# EAGLE design Asistente_Alzhaimer (EAGLE 7.6.0)
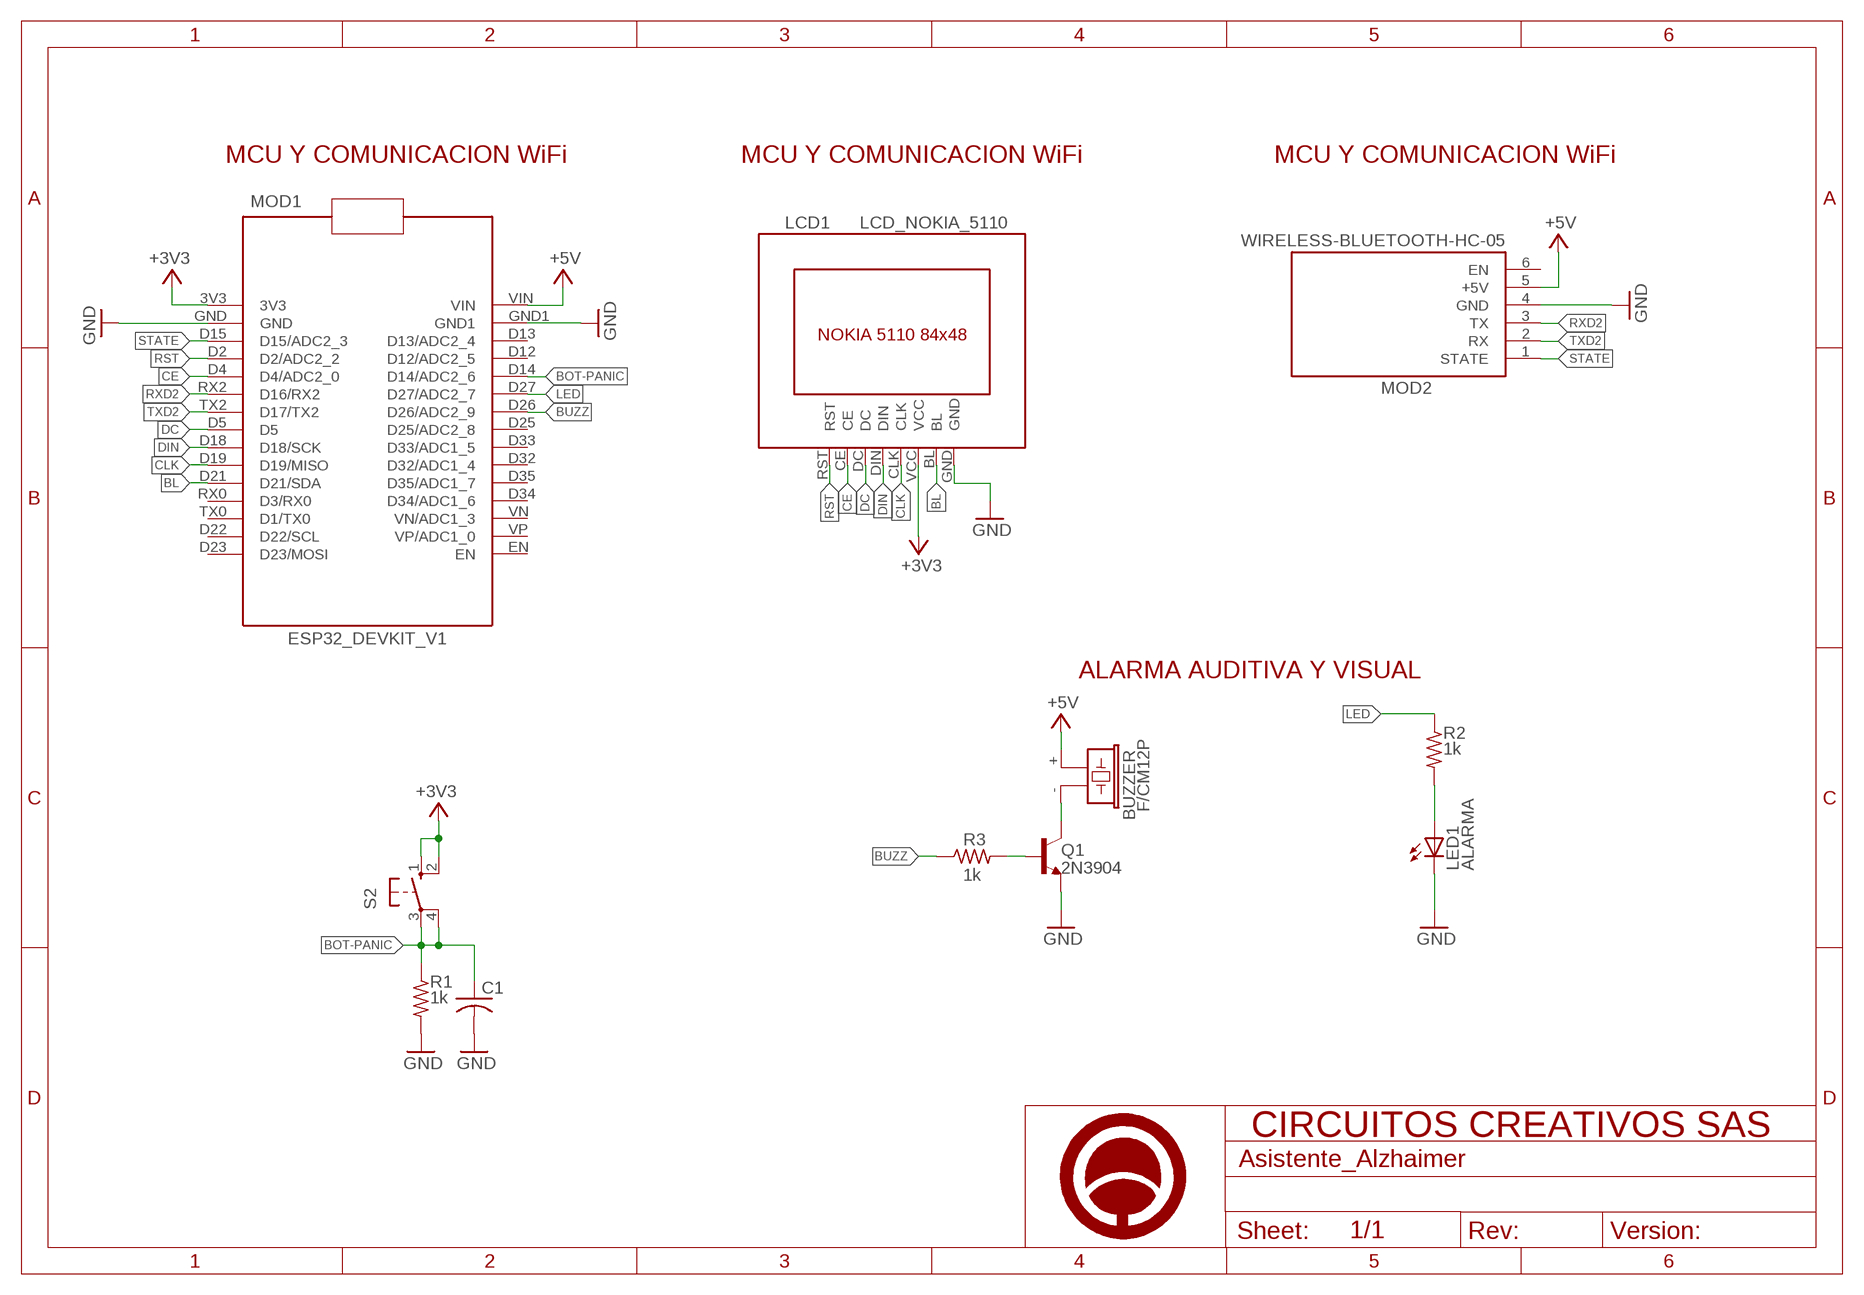
[diagram p0: schematic, sheet 1]

## Parts
BUZZER  F/CM12P  [F/CM12P]
C1  C-US050-025X075  [C050-025X075]
LCD1  LCD_NOKIA_5110  [NOKIA_5110_THT]
LED1  ALARMA  LED3MM  [LED3MM]
MOD1  ESP32_DEVKIT_V1  [ESP32_DEVKIT_V1]
MOD2  WIRELESS-BLUETOOTH-HC-05  [WIRELESS-BLUETOOTH-HC-05]
Q1  2N3904  [TO-92]
R1  1k  R-US_0204/7  [0204/7]
R2  1k  R-US_0204/7  [0204/7]
R3  1k  R-US_0204/7  [0204/7]
S2  10-XX  [B3F-10XX]
U$1  A4_HORIZONTAL  [LOGO]

## Nets
+3V3: LCD1.VCC MOD1.3V3 S2.1(S) S2.2(S1)
+5V: BUZZER.+ MOD1.VIN MOD2.5(+5V)
BL: LCD1.BL MOD1.D21(D21/SDA)
BOT-PANIC: C1.1 MOD1.D14(D14/ADC2_6) R1.1 S2.3(P) S2.4(P1)
BUZZ: MOD1.D26(D26/ADC2_9) R3.1
CE: LCD1.CE MOD1.D4(D4/ADC2_0)
CLK: LCD1.CLK MOD1.D19(D19/MISO)
DC: LCD1.DC MOD1.D5
DIN: LCD1.DIN MOD1.D18(D18/SCK)
GND [PWR]: C1.2 LCD1.GND LED1.K(C) MOD1.GND MOD1.GND1 MOD2.4(GND) Q1.1(E) R1.2
LED: MOD1.D27(D27/ADC2_7) R2.1
N$1: LED1.A R2.2
N$7: Q1.2(B) R3.2
N$9: BUZZER.- Q1.3(C)
RST: LCD1.RST MOD1.D2(D2/ADC2_2)
RXD2: MOD1.RX2(D16/RX2) MOD2.3(TX)
STATE: MOD1.D15(D15/ADC2_3) MOD2.1(STATE)
TXD2: MOD1.TX2(D17/TX2) MOD2.2(RX)
Unconnected: MOD1.D12(D12/ADC2_5) MOD1.D13(D13/ADC2_4) MOD1.D22(D22/SCL) MOD1.D23(D23/MOSI) MOD1.D25(D25/ADC2_8) MOD1.D32(D32/ADC1_4) MOD1.D33(D33/ADC1_5) MOD1.D34(D34/ADC1_6) MOD1.D35(D35/ADC1_7) MOD1.EN MOD1.RX0(D3/RX0) MOD1.TX0(D1/TX0) MOD1.VN(VN/ADC1_3) MOD1.VP(VP/ADC1_0) MOD2.6(EN)

## Notes on the sheet
- MCU Y COMUNICACION WiFi | MCU Y COMUNICACION WiFi | MCU Y COMUNICACION WiFi
- ALARMA AUDITIVA Y VISUAL

## Library data of the parts
BUZZER = buzzer:F/CM12P: BUZZER Source: Buerklin; OC_FARNELL: unknown; OC_NEWARK: unknown
C1 = rcl:C-US: CAPACITOR, American symbol
LCD1 = Circuitos-Creativos-Modulos:LCD_NOKIA_5110: MODULO LCD NOKIA 5110, 84x48 pixeles 3.3V
LED1 = led:LED: LED OSRAM: - CHIPLED LG R971, LG N971, LY N971, LG Q971, LY Q971, LO R971, LY R971 LH N974, LH R974 LS Q976, LO Q976, LY Q976 LO Q996 - Hyper CHIPLED LW Q18S LB Q993, LB Q99A, LB R99A - SideLED LS A670, LO A670, LY A670, LG A670, LP A670 LB A673, LV A673, LT A673, LW A673 LH A674 LY A675 LS A676, LA A676, LO A676, LY A676, LW A676 LS A679, LY A679, LG A679 - Hyper Micro SIDELED® LS Y876, LA Y876, LO Y876, LY Y876 LT Y87S - SmartLED LW L88C, LW L88S LB L89C, LB L89S, LG L890 LS L89K, LO L89K, LY L89K LS L896, LA L896, LO L896, LY L896 - TOPLED LS T670, LO T670, LY T670, LG T670, LP T670 LSG T670, LSP T670, LSY T670, LOP T670, LYG T670 LG T671, LOG T671, LSG T671 LB T673, LV T673, LT T673, LW T673 LH T674 LS T676, LA T676, LO T676, LY T676, LB T676, LH T676, LSB T676, LW T676 LB T67C, LV T67C, LT T67C, LS T67K, LO T67K, LY T67K, LW E67C LS E67B, LA E67B, LO E67B, LY E67B, LB E67C, LV E67C, LT E67C LW T67C LS T679, LY T679, LG T679 LS T770, LO T770, LY T770, LG T770, LP T770 LB T773, LV T773, LT T773, LW T773 LH T774 LS E675, LA E675, LY E675, LS T675 LS T776, LA T776, LO T776, LY T776, LB T776 LHGB T686 LT T68C, LB T68C - Hyper Mini TOPLED® LB M676 - Mini TOPLED Santana® LG M470 LS M47K, LO M47K, LY M47K Source: http://www.osram.convergy.de LUXEON: - LUMILED® LXK2-PW12-R00, LXK2-PW12-S00, LXK2-PW14-U00, LXK2-PW14-V00 LXK2-PM12-R00, LXK2-PM12-S00, LXK2-PM14-U00 LXK2-PE12-Q00, LXK2-PE12-R00, LXK2-PE12-S00, LXK2-PE14-T00, LXK2-PE14-U00 LXK2-PB12-K00, LXK2-PB12-L00, LXK2-PB12-M00, LXK2-PB14-N00, LXK2-PB14-P00, LXK2-PB14-Q00 LXK2-PR12-L00, LXK2-PR12-M00, LXK2-PR14-Q00, LXK2-PR14-R00 LXK2-PD12-Q00, LXK2-PD12-R00, LXK2-PD12-S00 LXK2-PH12-R00, LXK2-PH12-S00 LXK2-PL12-P00, LXK2-PL12-Q00, LXK2-PL12-R00 Source: www.luxeon.com KINGBRIGHT: KA-3528ASYC Source: www.kingbright.com
MOD1 = Circuitos-Creativos-Modulos:ESP32_DEVKIT_V1: Microprocesador de doble nucleo a 80MHz, con WiFi y bBluetooth 4.2, ideal para aplicaciones IOT
MOD2 = diy-modules:WIRELESS-BLUETOOTH-HC-05: Bluetooth Transceiver Module based on HC-05 board Tutorial is available here: https://arduino-info.wikispaces.com/BlueTooth-HC05-HC06-Modules-How-To Click here to find device on ebay.com <http://www.ebay.com/sch/hc-05+module+rs232>
Q1 = Ingenialo:2N3904: transistor NPN de proposito general
R1-R3 = rcl:R-US_: RESISTOR, American symbol
S2 = switch-omron:10-XX: OMRON SWITCH; MPN: B3F-1000; OC_FARNELL: 176432; OC_NEWARK: 36M3542
U$1 = Circuitos-Creativos-Estilos:A4_HORIZONTAL

## Net classes
1 PWR: width 0.305 mm, clearance 0.254 mm

## Board
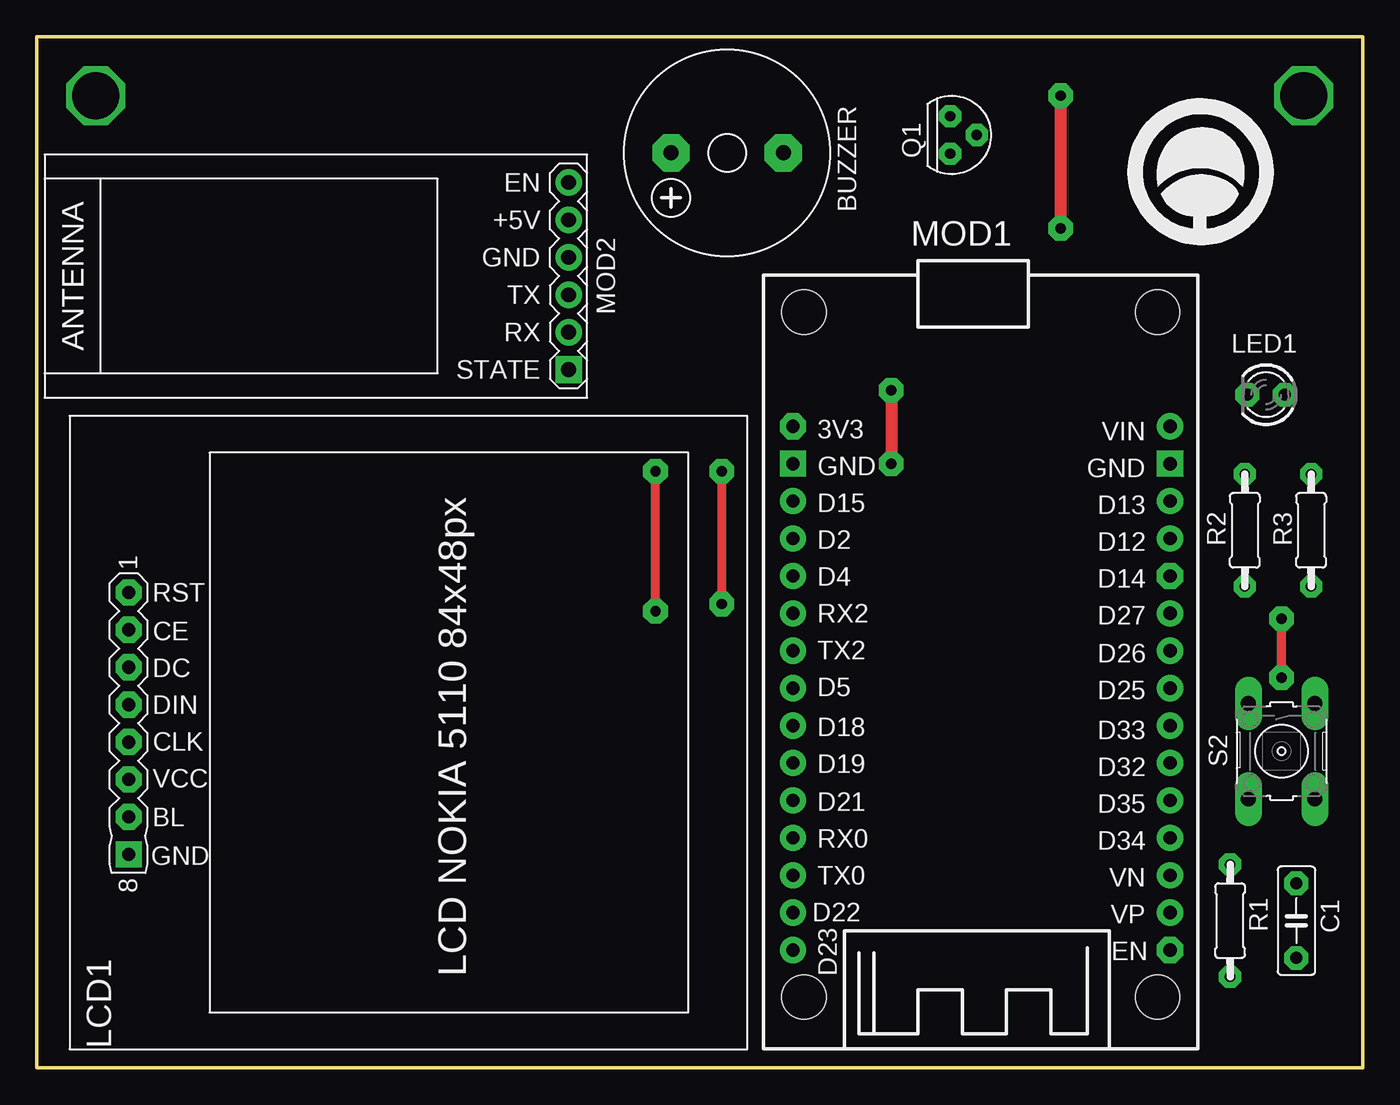
[diagram p1: board, top side]
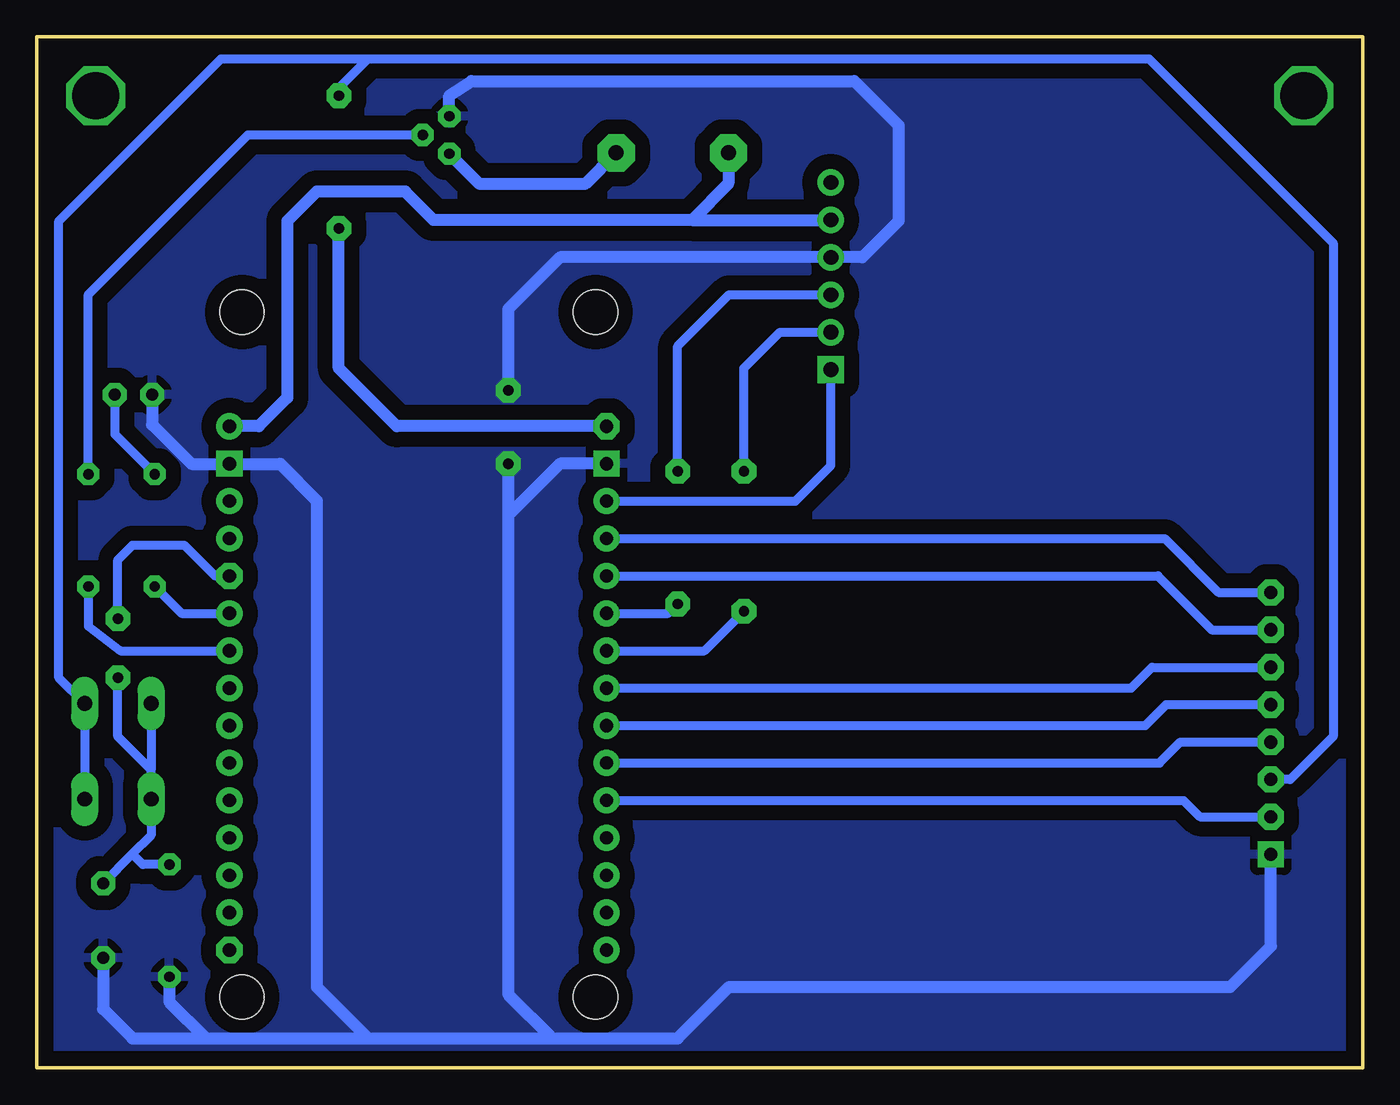
[diagram p2: board, bottom side, seen from below]

Size 90 x 70 mm. Coordinates in mm from the lower left corner, seen from the top.
Outline: 0,0 90,0 90,70 0,70 0,0
Copper layers (1*16): Top 0.035mm / dielectric 1.5mm / Bottom 0.035mm
Design rules "Crcuitos creativos": minimum track width 0.35mm, minimum drill 0.6mm, track to track 10mil, track to pad 10mil, pad to pad 10mil, via to via 10mil, smd to smd 8mil, copper to edge 0.5mm, drill to drill 0.3mm, minimum pad ring 0.4mm, minimum via ring 0.4mm, stop-mask expansion 4mil, vias tented up to drill 0mil, thermal gap 20mil

### Footprints (pad centres in the part's own frame; a part is rotated, then mirrored left to right if it is on the bottom)
F/CM12P = drill 1.016 pad 2.54 octagon: + 3.81,0; - -3.81,0
C050-025X075 = drill 0.813 octagon: 1 -2.54,0; 2 2.54,0
NOKIA_5110_THT = drill 0.9 pad 1.778 octagon: BL 27.225,4; CE 14.525,4; CLK 22.145,4; DC 17.065,4; DIN 19.605,4; RST 11.985,4; VCC 24.685,4 | drill 0.9 pad 1.778 square: GND 29.765,4
LED3MM = drill 0.813 octagon: A -1.27,0; K 1.27,0
ESP32_DEVKIT_V1 = drill 0.9 pad 1.778 octagon: 3V3 2,42.252; D14 27.6,32.092; EN 27.6,6.692 | drill 0.9 pad 1.778: D2 2,34.632; D4 2,32.092; D5 2,24.472; D12 27.6,34.632; D13 27.6,37.172; D15 2,37.172; D18 2,21.932; D19 2,19.392; D21 2,16.852; D22 2,9.232; D23 2,6.692; D25 27.6,24.472; D26 27.6,27.012; D27 27.6,29.552; D32 27.6,19.392; D33 27.6,21.932; D34 27.6,14.312; D35 27.6,16.852; RX0 2,14.312; RX2 2,29.552; TX0 2,11.772; TX2 2,27.012; VIN 27.6,42.252; VN 27.6,11.772; VP 27.6,9.232 | drill 0.9 pad 1.778 square: GND 2,39.712; GND1 27.6,39.712 | hole 3: 26.75,3.5; 2.75,3.5; 2.75,50; 26.75,50
WIRELESS-BLUETOOTH-HC-05 = drill 1 square: 1 -6.35,-17.145 | drill 1: 2 -3.81,-17.145; 3 -1.27,-17.145; 4 1.27,-17.145; 5 3.81,-17.145; 6 6.35,-17.145
TO-92 = drill 0.7 pad 1.27 octagon: 1 -1.37,-0.3; 2 -0.1,1.505; 3 1.17,-0.3
0204/7 = drill 0.7 pad 1.422 octagon: 1 -3.81,0; 2 3.81,0
B3F-10XX = drill 1.016 long: 1 -3.251,2.261; 2 3.251,2.261; 3 -3.251,-2.261; 4 3.251,-2.261

### Placement (x,y rotation side)
BUZZER  46.86,62.12 180 top
C1  85.5,10 270 top
LCD1  2.23,44.27 270 top
LED1  83.44,45.7 180 top
MOD1  49.32,1.31 0 top
MOD2  18.95,53.76 90 top
Q1  62.3,63.24 270 top
R1  81,10 270 top
R2  82,36.5 90 top
R3  86.5,36.5 90 top
S2  84.5,21.5 270 top
U$1  79,60.84 0 top

### Tracks (layer width: path | path; a pad name or v marks a point on that pad's centre or on a via)
+3V3  (via drill 0.7 pad 1.68)
  Top 0.813: v69.5,57 v69.5,66
  Bottom 0.61: 67.5,68.5 77.5,68.5 88.5,57.5 88.5,26.49 S2.1 S2.2 | 67.5,68.5 14.5,68.5 2,56 2,22.5 4.92,19.59 LCD1.VCC | v69.5,66 69.5,66.5 67.5,68.5
  Bottom 0.813: MOD1.3V3 65.56,43.56 69.5,47.5 v69.5,57
+5V
  Bottom 0.813: BUZZER.+ 43.05,60.05 45.53,57.57 | 45.53,57.57 MOD2.5 | 45.53,57.57 63.07,57.57 65,59.5 71,59.5 73,57.5 73,45.5 74.94,43.56 MOD1.VIN
BL
  Bottom 0.61: MOD1.D21 12.16,18.16 11.04,17.05 LCD1.BL
BOT-PANIC  (via drill 0.7 pad 1.68)
  Top 0.61: v84.5,26.5 v84.5,30.5
  Bottom 0.61: 83.52,14.52 82.24,15.8 S2.4 82.24,20 82.24,20.24 | 83.52,14.52 C1.1 | R1.1 82.81,13.81 83.52,14.52 | 82.24,20.24 84.5,22.5 v84.5,26.5 | v84.5,30.5 84.5,34.5 83.5,35.5 80,35.5 77.9,33.4 MOD1.D14 | S2.3 82.24,20.24
BUZZ
  Bottom 0.61: R3.1 86.5,30 84.32,28.32 MOD1.D26
CE
  Bottom 0.61: MOD1.D4 13.9,33.4 10.24,29.75 LCD1.CE
CLK
  Bottom 0.61: MOD1.D19 13.8,20.7 12.38,22.12 LCD1.CLK
DC
  Bottom 0.61: MOD1.D5 15.72,25.78 14.29,27.2 LCD1.DC
DIN
  Bottom 0.61: MOD1.D18 14.76,23.24 13.34,24.66 LCD1.DIN
GND  (via drill 0.7 pad 1.68)
  Top 0.813: v58,46 v58,41.02
  Bottom 0.813: C1.2 85.5,4 83.5,2 78.5,2 | 78.5,2 67.5,2 | 67.5,2 55,2 | 55,2 46.5,2 43,5.5 9,5.5 6.23,8.27 LCD1.GND | LED1.K 82.17,43.67 79.5,41 76.94,41 | 76.94,41 MOD1.GND1 | R1.2 81,4.5 78.5,2 | Q1.1 62,66 60.5,67 34.5,67 31.5,64 31.5,57.5 33.97,55.03 MOD2.4 54.47,55.03 58,51.5 v58,46 | 76.94,41 73.5,41 | 73.5,41 71,38.5 71,5.5 67.5,2 | 73.48,41.02 73.5,41 | v58,41.02 58,37.5 | 58,37.5 58,5 55,2 | MOD1.GND 54.48,41.02 58,37.5
  pour Bottom (isolate 1.016): -1,-1 91,-1 91,71 -1,71
LED
  Bottom 0.61: R2.1 80.17,30.86 MOD1.D27
N$1
  Bottom 0.61: LED1.A 84.71,43.02 R2.2
N$2  (via drill 3.2 pad 3.81)
  other vias: 4,66
N$3  (via drill 3.2 pad 3.81)
  other vias: 86,66
N$7
  Bottom 0.61: R3.2 86.5,52.5 75.66,63.34 Q1.2
N$9
  Bottom 0.813: BUZZER.- 52.79,60 59.93,60 Q1.3
RST
  Bottom 0.61: MOD1.D2 13.44,35.94 9.79,32.28 LCD1.RST
RXD2  (via drill 0.7 pad 1.68)
  Top 0.61: v46.5,31.5 v46.5,40.5
  Bottom 0.61: MOD1.RX2 47.14,30.86 v46.5,31.5 | v46.5,40.5 46.5,49 43.01,52.49 MOD2.3
STATE
  Bottom 0.61: MOD1.D15 38.52,38.48 36.09,40.91 MOD2.1
TXD2  (via drill 0.7 pad 1.68)
  Top 0.61: v42,31 v42,40.5
  Bottom 0.61: MOD1.TX2 44.68,28.32 v42,31 | v42,40.5 42,47.5 39.55,49.95 MOD2.2